# EAGLE schematic nixie_test_v1 (EAGLE 6.1)
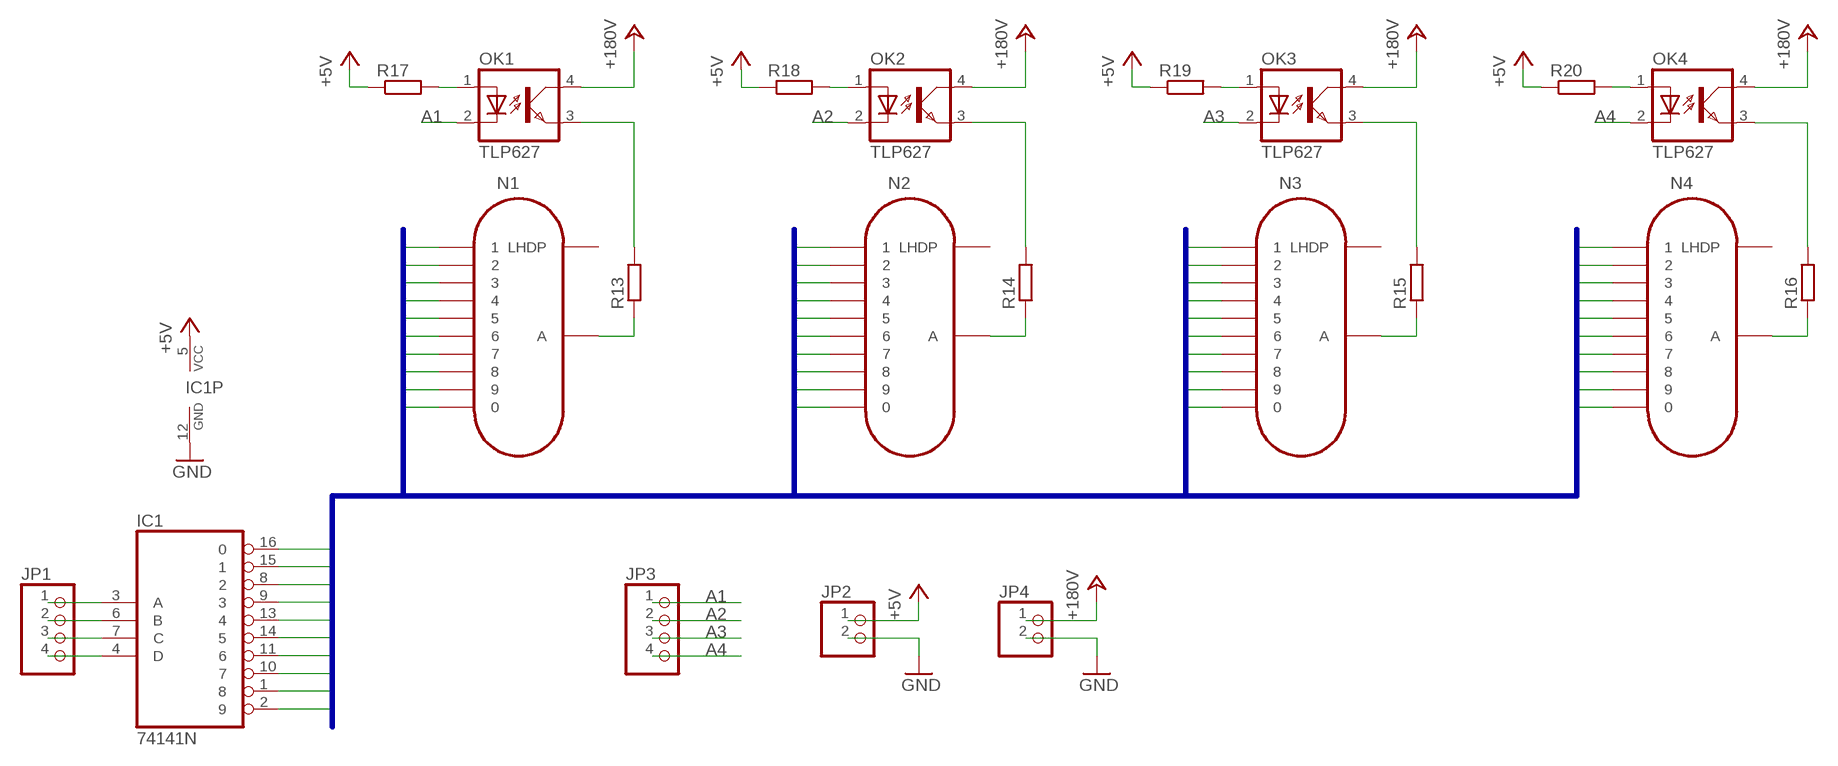
[diagram p0: schematic, sheet 1]

## Parts
IC1  74141N  [DIL16]
JP1  PINHD-1X4  [1X04]
JP2  PINHD-1X2  [1X02]
JP3  PINHD-1X4  [1X04]
JP4  PINHD-1X2  [1X02]
N1  IN-12B  [IN-12]
N2  IN-12B  [IN-12]
N3  IN-12B  [IN-12]
N4  IN-12B  [IN-12]
OK1  TLP627  [4-SMD]
OK2  TLP627  [4-SMD]
OK3  TLP627  [4-SMD]
OK4  TLP627  [4-SMD]
R13  R-EU_10  [0207/10]
R14  R-EU_10  [0207/10]
R15  R-EU_10  [0207/10]
R16  R-EU_10  [0207/10]
R17  R-EU_10  [0207/10]
R18  R-EU_10  [0207/10]
R19  R-EU_10  [0207/10]
R20  R-EU_10  [0207/10]

## Nets
+5V: IC1.5(VCC) JP2.1 R17.1 R18.1 R19.1 R20.1
+24V: JP4.1 OK1.4(COL) OK2.4(COL) OK3.4(COL) OK4.4(COL) ; supply symbol labelled +180V
A1: JP3.1 OK1.2(C)
A2: JP3.2 OK2.2(C)
A3: JP3.3 OK3.2(C)
A4: JP3.4 OK4.2(C)
C0: IC1.16 N1.0 N2.0 N3.0 N4.0
C1: IC1.15 N1.1 N2.1 N3.1 N4.1
C2: IC1.8 N1.2 N2.2 N3.2 N4.2
C3: IC1.9 N1.3 N2.3 N3.3 N4.3
C4: IC1.13 N1.4 N2.4 N3.4 N4.4
C5: IC1.14 N1.5 N2.5 N3.5 N4.5
C6: IC1.11 N1.6 N2.6 N3.6 N4.6
C7: IC1.10 N1.7 N2.7 N3.7 N4.7
C8: IC1.1 N1.8 N2.8 N3.8 N4.8
C9: IC1.2 N1.9 N2.9 N3.9 N4.9
GND: IC1.12(GND) JP2.2 JP4.2
N$1: IC1.3(A) JP1.1
N$2: IC1.6(B) JP1.2
N$3: IC1.7(C) JP1.3
N$4: IC1.4(D) JP1.4
N$13: N1.A R13.1
N$14: OK1.3(EMIT) R13.2
N$15: N2.A R14.1
N$16: OK2.3(EMIT) R14.2
N$17: N3.A R15.1
N$18: OK3.3(EMIT) R15.2
N$19: N4.A R16.1
N$20: OK4.3(EMIT) R16.2
N$21: OK1.1(A) R17.2
N$22: OK2.1(A) R18.2
N$23: OK3.1(A) R19.2
N$24: OK4.1(A) R20.2
Unconnected: N1.LHDP N2.LHDP N3.LHDP N4.LHDP

## Buses
C[0..9]

## Library data of the parts
IC1 = nixie_tube:74*141: BCD to decimal DECODER/DRIVER
JP1 JP3 = nixie_tube:PINHD-1X4: PIN HEADER
JP2 JP4 = nixie_tube:PINHD-1X2: PIN HEADER
N1-N4 = nixie_tube:IN-12B: IN-12B: medium numeric topview nixie tube
OK1-OK4 = nixie_tube:TLP627: TOSHIBA PHOTOCOUPLER GaAs IRED & PHOTO-TRANSISTOR Source: http://www.semicon.toshiba.co.jp/td/en/Opto/Photocoupler/en_20050928_TLP283_datasheet.pdf; OC_FARNELL: unknown; OC_NEWARK: unknown
R13-R20 = nixie_tube:R-EU_: RESISTOR, European symbol